# Altium schematic sheet MAIN.SchDoc
size A4
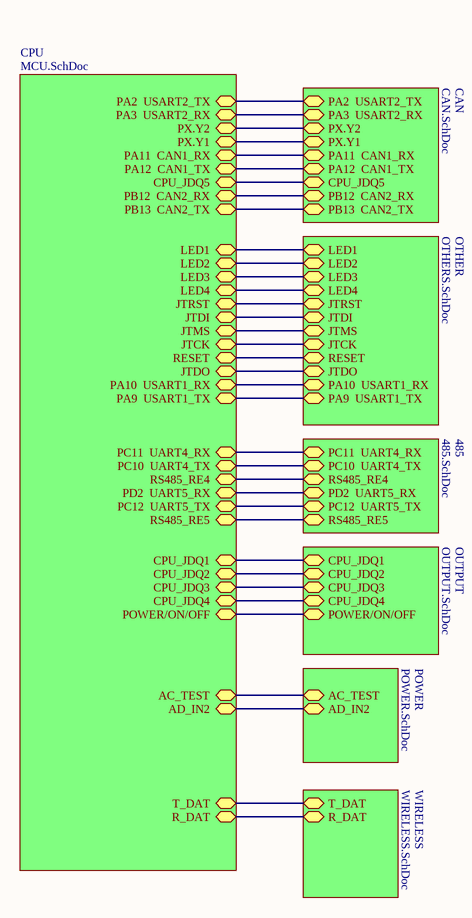
[diagram p0: MAIN.SchDoc]

## Sub-sheets
485 = 485.SchDoc: PC11  UART4_RX, PC10  UART4_TX, RS485_RE4, PD2  UART5_RX, PC12  UART5_TX, RS485_RE5
CAN = CAN.SchDoc: PX.Y1, PA11  CAN1_RX, PA12  CAN1_TX, CPU_JDQ5, PX.Y2, PB12  CAN2_RX, PB13  CAN2_TX, PA2  USART2_TX, PA3  USART2_RX
CPU = MCU.SchDoc: PA2  USART2_TX, PA3  USART2_RX, POWER/ON/OFF, PA9  USART1_TX, PA10  USART1_RX, PA11  CAN1_RX, PA12  CAN1_TX, JTMS, JTCK, JTDI, T_DAT, R_DAT, JTDO, JTRST, PB12  CAN2_RX, PB13  CAN2_TX, RESET, AD_IN2, AC_TEST, CPU_JDQ1, CPU_JDQ2, CPU_JDQ3, CPU_JDQ4, PC10  UART4_TX, PC11  UART4_RX, PC12  UART5_TX, RS485_RE4, RS485_RE5, LED1, LED2, LED3, LED4, PX.Y2, PX.Y1, PD2  UART5_RX, CPU_JDQ5
OTHER = OTHERS.SchDoc: LED1, LED2, LED3, LED4, JTRST, JTDI, JTMS, JTCK, RESET, JTDO, PA10  USART1_RX, PA9  USART1_TX
OUTPUT = OUTPUT.SchDoc: CPU_JDQ1, CPU_JDQ2, CPU_JDQ3, CPU_JDQ4, POWER/ON/OFF
POWER = POWER.SchDoc: AC_TEST, AD_IN2
WIRELESS = WIRELESS.SchDoc: T_DAT, R_DAT

## Nets
(unnamed): sheet CPU/PA2  USART2_TX, sheet CAN/PA2  USART2_TX
(unnamed): sheet CPU/PA3  USART2_RX, sheet CAN/PA3  USART2_RX
(unnamed): sheet CPU/POWER/ON/OFF, sheet OUTPUT/POWER/ON/OFF
(unnamed): sheet CPU/PA9  USART1_TX, sheet OTHER/PA9  USART1_TX
(unnamed): sheet CPU/PA10  USART1_RX, sheet OTHER/PA10  USART1_RX
(unnamed): sheet CPU/PA11  CAN1_RX, sheet CAN/PA11  CAN1_RX
(unnamed): sheet CPU/PA12  CAN1_TX, sheet CAN/PA12  CAN1_TX
(unnamed): sheet CPU/JTMS, sheet OTHER/JTMS
(unnamed): sheet CPU/JTCK, sheet OTHER/JTCK
(unnamed): sheet CPU/JTDI, sheet OTHER/JTDI
(unnamed): sheet CPU/T_DAT, sheet WIRELESS/T_DAT
(unnamed): sheet CPU/R_DAT, sheet WIRELESS/R_DAT
(unnamed): sheet CPU/JTDO, sheet OTHER/JTDO
(unnamed): sheet CPU/JTRST, sheet OTHER/JTRST
(unnamed): sheet CPU/PB12  CAN2_RX, sheet CAN/PB12  CAN2_RX
(unnamed): sheet CPU/PB13  CAN2_TX, sheet CAN/PB13  CAN2_TX
(unnamed): sheet CPU/RESET, sheet OTHER/RESET
(unnamed): sheet CPU/AD_IN2, sheet POWER/AD_IN2
(unnamed): sheet CPU/AC_TEST, sheet POWER/AC_TEST
(unnamed): sheet CPU/CPU_JDQ1, sheet OUTPUT/CPU_JDQ1
(unnamed): sheet CPU/CPU_JDQ2, sheet OUTPUT/CPU_JDQ2
(unnamed): sheet CPU/CPU_JDQ3, sheet OUTPUT/CPU_JDQ3
(unnamed): sheet CPU/CPU_JDQ4, sheet OUTPUT/CPU_JDQ4
(unnamed): sheet CPU/PC10  UART4_TX, sheet 485/PC10  UART4_TX
(unnamed): sheet CPU/PC11  UART4_RX, sheet 485/PC11  UART4_RX
(unnamed): sheet CPU/PC12  UART5_TX, sheet 485/PC12  UART5_TX
(unnamed): sheet CPU/RS485_RE4, sheet 485/RS485_RE4
(unnamed): sheet CPU/RS485_RE5, sheet 485/RS485_RE5
(unnamed): sheet CPU/LED1, sheet OTHER/LED1
(unnamed): sheet CPU/LED2, sheet OTHER/LED2
(unnamed): sheet CPU/LED3, sheet OTHER/LED3
(unnamed): sheet CPU/LED4, sheet OTHER/LED4
(unnamed): sheet CPU/PX.Y2, sheet CAN/PX.Y2
(unnamed): sheet CPU/PX.Y1, sheet CAN/PX.Y1
(unnamed): sheet CPU/PD2  UART5_RX, sheet 485/PD2  UART5_RX
(unnamed): sheet CPU/CPU_JDQ5, sheet CAN/CPU_JDQ5